# EAGLE schematic PressureSensorAdaptor (EAGLE 7.2.0)
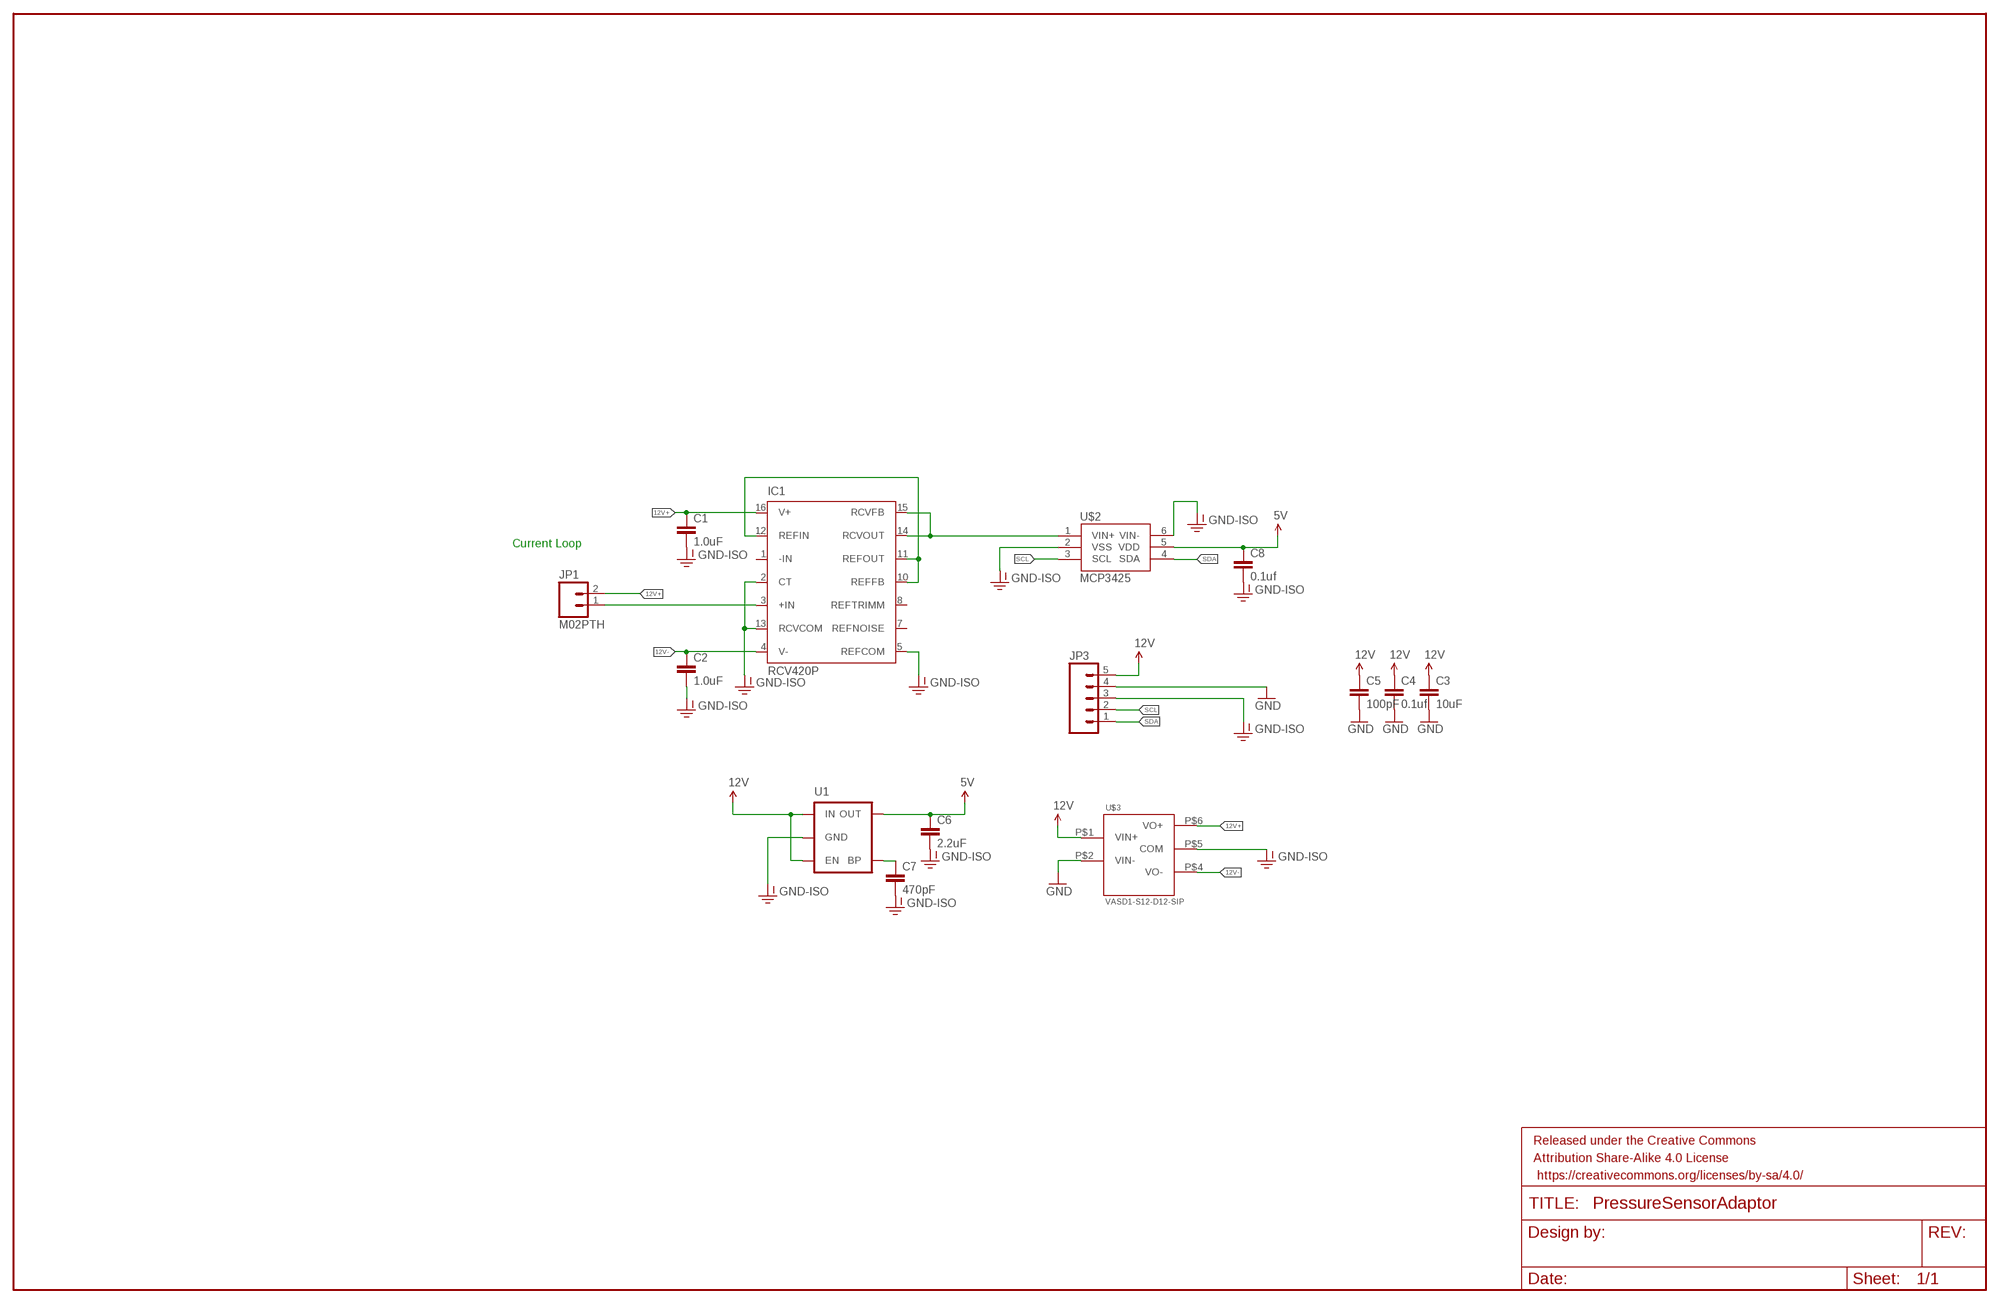
[diagram p0: schematic, sheet 1]

## Parts
C1  1.0uF  1.0UF-25V-+80/-20(0805)  [0805]
C2  1.0uF  1.0UF-25V-+80/-20(0805)  [0805]
C3  10uF  CAP0805  [0805]
C4  0.1uf  CAP0805  [0805]
C5  100pF  CAP0805  [0805]
C6  2.2uF  2.2UF-25V-+80/-20(0805)  [0805]
C7  470pF  470PF-50V-5%(0603)SMD  [0603-CAP]
C8  0.1uf  CAP0805  [0805]
FRAME1  FRAME-LEDGER  [CREATIVE_COMMONS]
IC1  RCV420P  [DIL16]
JP1  M02PTH  [1X02]
JP3  M05PTH  [1X05]
U1  MIC52055V  [SOT23-5]
U$2  MCP3425  [SOT23-6]
U$3  VASD1-S12-D12-SIP  [VASD1-S12-D12-SIP]

## Nets
5V: C6.1 C8.1 U1.5(OUT) U$2.5(VDD)
12V: C3.1 C4.1 C5.1 JP3.5 U1.1(IN) U1.3(EN) U$3.P$1(VIN+)
12V+: C1.1 IC1.16(V+) JP1.2 U$3.P$6(VO+)
12V-: C2.1 IC1.4(V-) U$3.P$4(VO-)
GND: C3.2 C4.2 C5.2 JP3.4 U$3.P$2(VIN-)
GND-ISO: C1.2 C2.2 C6.2 C7.2 C8.2 IC1.2(CT) IC1.5(REFCOM) IC1.13(RCVCOM) JP3.3 U1.2(GND) U$2.2(VSS) U$2.6(VIN-) U$3.P$5(COM)
N$1: IC1.10(REFFB) IC1.11(REFOUT) IC1.12(REFIN)
N$2: IC1.3(+IN) JP1.1
N$11: C7.1 U1.4(BP)
SCL: JP3.2 U$2.3(SCL)
SDA: JP3.1 U$2.4(SDA)
VOUT: IC1.14(RCVOUT) IC1.15(RCVFB) U$2.1(VIN+)
Unconnected: IC1.1(-IN) IC1.7(REFNOISE) IC1.8(REFTRIMM)

## Notes on the sheet
- Current Loop

## Library data of the parts
C1 C2 = SparkFun-Capacitors:1.0UF-25V-+80/-20(0805): CAP-11625; PROD_ID: CAP-11625
C3 = SparkFun-Capacitors:CAP: Capacitor Standard 0603 ceramic capacitor, and 0.1" leaded capacitor.; DIGIKEY: 490-3886-1-ND
C4 C5 C8 = SparkFun-Capacitors:CAP: Capacitor Standard 0603 ceramic capacitor, and 0.1" leaded capacitor.
C6 = SparkFun-Capacitors:2.2UF-25V-+80/-20(0805): CAP-11624; PROD_ID: CAP-11624
C7 = SparkFun-Capacitors:470PF-50V-5%(0603): CAP-07884; PROD_ID: CAP-07884
FRAME1 = SparkFun-Aesthetics:FRAME-LEDGER: Schematic Frame Standard 11x14 US Ledger frame; DESIGNER: Roy Cohen; VERSION: A
IC1 = burr-brown:RCV420: Precision 4mA to 20mA CURRENT LOOP RECEIVER Source: http://focus.ti.com/lit/ds/symlink/rcv420.pdf; MF: TEXAS INSTRUMENTS; MPN: RCV420JP; OC_FARNELL: 1212342; OC_NEWARK: 60K6765
JP1 = SparkFun-Connectors:M02: Standard 2-pin 0.1" header. Use with - straight break away headers ( PRT-00116) - right angle break away headers (PRT-00553) - swiss pins (PRT-00743) - machine pins (PRT-00117) - female headers (PRT-00115) Molex polarized connector foot print use with: PRT-08233 with associated crimp pins and housings. 2.54_SCREWTERM for use with PRT-10571. 3.5mm Screw Terminal footprints for PRT-08084 5mm Screw Terminal footprints for use with PRT-08432
JP3 = SparkFun-Connectors:M05: Header 5 Standard 5-pin 0.1" header. Use with straight break away headers (SKU : PRT-00116), right angle break away headers (PRT-00553), swiss pins (PRT-00743), machine pins (PRT-00117), and female headers (PRT-00115). Molex polarized connector foot print use with SKU : PRT-08230 with associated crimp pins and housings.
U1 = SparkFun-PowerIC:MIC5205: MIC5205 150mA vreg 3.3V - VREG-00822 5V - VREG-00823; PROD_ID: VREG-00823
U$2 = RitLaunchInitiative:MCP3425: Single channel ADC http://ww1.microchip.com/downloads/en/DeviceDoc/22072b.pdf
U$3 = RitLaunchInitiative:VASD1-S12-D12-SIP: DC to DC converter 12v to +12v, -12v http://www.cui.com/product/resource/vasd1-sip.pdf